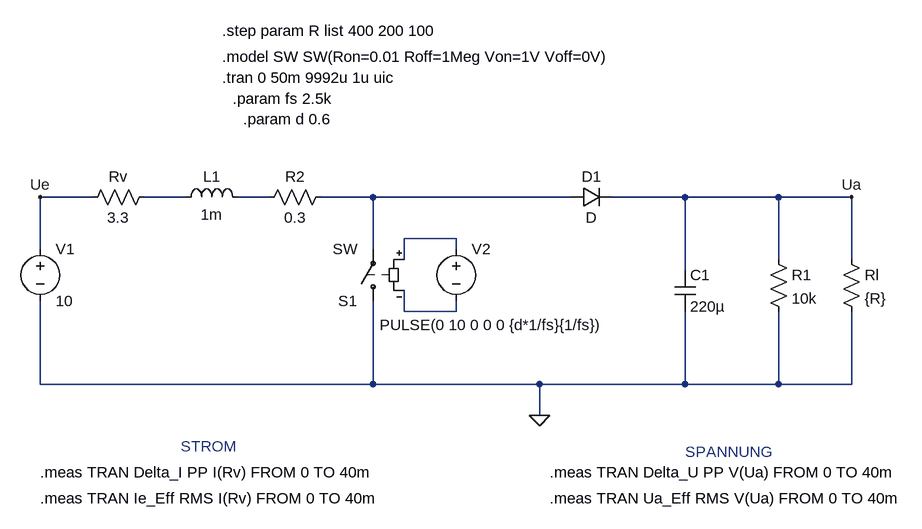
[diagram p0: schematic C4 HSS 3.asc]
C4 HSS 3.asc, the LTspice schematic file:
Version 4.1
SHEET 1 924 680
WIRE -368 -32 -448 -32
WIRE -224 -32 -288 -32
WIRE -96 -32 -144 -32
WIRE 64 -32 -16 -32
WIRE 368 -32 64 -32
WIRE 544 -32 432 -32
WIRE 688 -32 544 -32
WIRE 800 -32 688 -32
WIRE 192 32 112 32
WIRE -448 48 -448 -32
WIRE 64 48 64 -32
WIRE 192 48 192 32
WIRE 112 64 112 32
WIRE 688 64 688 -32
WIRE 800 64 800 -32
WIRE 544 80 544 -32
WIRE 112 144 112 112
WIRE 192 144 192 128
WIRE 192 144 112 144
WIRE -448 256 -448 128
WIRE 64 256 64 128
WIRE 64 256 -448 256
WIRE 320 256 64 256
WIRE 544 256 544 144
WIRE 544 256 320 256
WIRE 688 256 688 144
WIRE 688 256 544 256
WIRE 800 256 800 144
WIRE 800 256 688 256
WIRE 320 304 320 256
FLAG -448 -32 Ue
FLAG 800 -32 Ua
FLAG 320 304 0
SYMBOL voltage -448 32 R0
SYMATTR InstName V1
SYMATTR Value 10
SYMBOL ind -240 -16 R270
WINDOW 0 32 56 VTop 2
WINDOW 3 5 56 VBottom 2
SYMATTR InstName L1
SYMATTR Value 1m
SYMBOL diode 368 -16 R270
WINDOW 0 32 32 VTop 2
WINDOW 3 0 32 VBottom 2
SYMATTR InstName D1
SYMBOL cap 528 80 R0
SYMATTR InstName C1
SYMATTR Value 220µ
SYMBOL res 784 48 R0
SYMATTR InstName Rl
SYMATTR Value {R}
SYMBOL voltage 192 32 R0
WINDOW 3 -118 133 Left 2
SYMATTR Value PULSE(0 10 0 0 0 {d*1/fs}{1/fs})
SYMATTR InstName V2
SYMBOL sw 64 144 R180
SYMATTR InstName S1
SYMBOL res 672 48 R0
SYMATTR InstName R1
SYMATTR Value 10k
SYMBOL res -272 -48 R90
WINDOW 0 0 56 VBottom 2
WINDOW 3 32 56 VTop 2
SYMATTR InstName Rv
SYMATTR Value 3.3
SYMBOL res 0 -48 R90
WINDOW 0 0 56 VBottom 2
WINDOW 3 32 56 VTop 2
SYMATTR InstName R2
SYMATTR Value 0.3
TEXT -168 -248 Left 2 !.model SW SW(Ron=0.01 Roff=1Meg Von=1V Voff=0V)
TEXT -168 -216 Left 2 !.tran 0 50m 9992u 1u uic
TEXT -448 392 Left 2 !.meas TRAN Delta_I PP I(Rv) FROM 0 TO 40m
TEXT -448 432 Left 2 !.meas TRAN Ie_Eff RMS I(Rv) FROM 0 TO 40m
TEXT 336 392 Left 2 !.meas TRAN Delta_U PP V(Ua) FROM 0 TO 40m
TEXT 336 432 Left 2 !.meas TRAN Ua_Eff RMS V(Ua) FROM 0 TO 40m
TEXT -232 352 Left 2 ;STROM
TEXT 544 360 Left 2 ;SPANNUNG
TEXT -152 -184 Left 2 !.param fs 2.5k
TEXT -136 -152 Left 2 !.param d 0.6
TEXT -168 -288 Left 2 !.step param R list 400 200 100

The netlist it stands for:
* C4 HSS 3.asc
V1 Ue 0 10
L1 N001 N002 1m
D1 N003 Ua D
C1 Ua 0 220µ
Rl Ua 0 {R}
V2 N004 N005 PULSE(0 10 0 0 0 {d*1/fs}{1/fs})
S1 0 N003 N004 N005 SW
R1 Ua 0 10k
Rv N001 Ue 3.3
R2 N003 N002 0.3
.model D D
.lib standard.dio
.model SW SW(Ron=0.01 Roff=1Meg Von=1V Voff=0V)
.tran 0 50m 9992u 1u uic
.meas TRAN Delta_I PP I(Rv) FROM 0 TO 40m
.meas TRAN Ie_Eff RMS I(Rv) FROM 0 TO 40m
.meas TRAN Delta_U PP V(Ua) FROM 0 TO 40m
.meas TRAN Ua_Eff RMS V(Ua) FROM 0 TO 40m
* STROM
* SPANNUNG
.param fs 2.5k
.param d 0.6
.step param R list 400 200 100
.backanno
.end